# EasyEDA Pro project RealisticPM_2026-10-08.epro, schematic segment_1
Create Date: 2025-02-17; Page Name: P1; Project Name: RealisticPM; Schematic Name: segment_1; Update Date: 2025-02-20; Company: EasyEDA.com; Page Size: A4; Version: V1.0
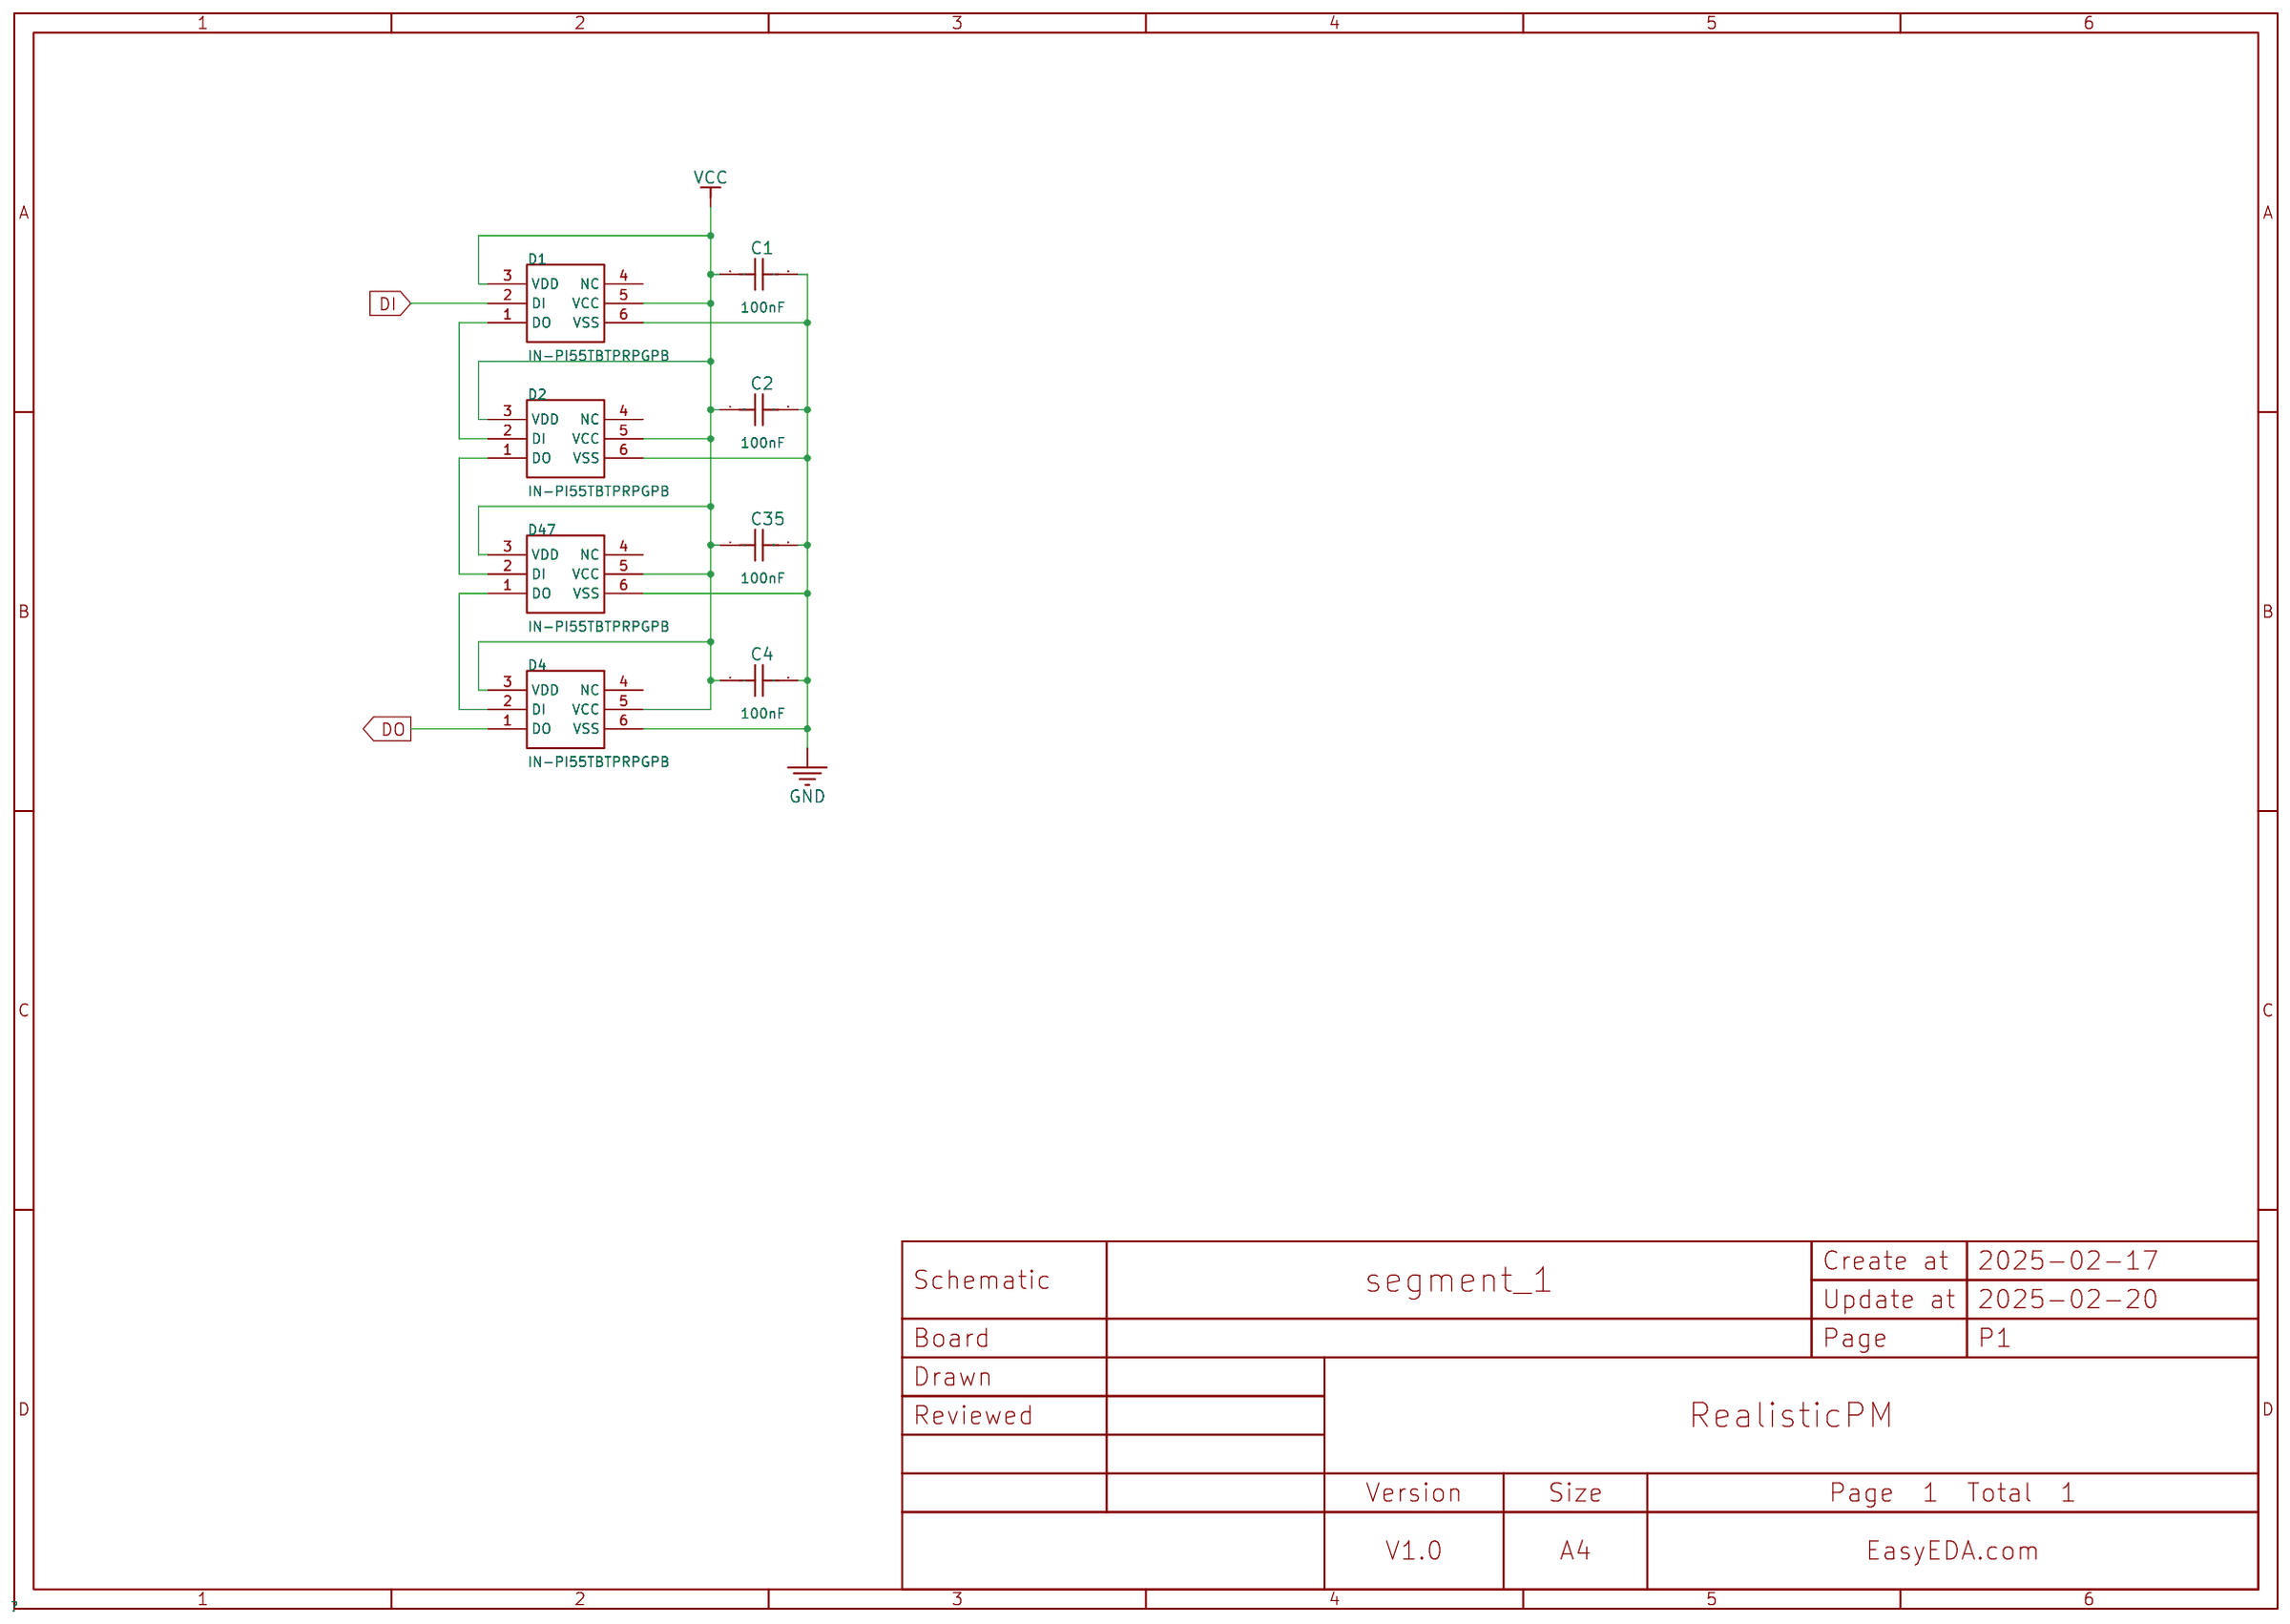
[diagram p1: schematic sheet]

## Parts
C1  100nF  [C0603]
C2  100nF  [C0603]
C4  100nF  [C0603]
C35  100nF  [C0603]
D1  IN-PI55TBTPRPGPB  [LED-SMD_6P-L5.0-W5.0-P1.60-LS5.4_A-SC5050ARGBC-B01-03-1T]
D2  IN-PI55TBTPRPGPB  [LED-SMD_6P-L5.0-W5.0-P1.60-LS5.4_A-SC5050ARGBC-B01-03-1T]
D4  IN-PI55TBTPRPGPB  [LED-SMD_6P-L5.0-W5.0-P1.60-LS5.4_A-SC5050ARGBC-B01-03-1T]
D47  IN-PI55TBTPRPGPB  [LED-SMD_6P-L5.0-W5.0-P1.60-LS5.4_A-SC5050ARGBC-B01-03-1T]

## Library data of the parts
C1 C2 C4 C35 = CL10B104KB8NNNC: Capacitance: Tolerance:±10% Tolerance:±10% Voltage Rated: Temperature Coefficient:; LCSC Part Name: 100nF ±10% 50V; Supplier Part: C1591; Manufacturer: SAMSUNG(三星); Supplier Footprint: 0603; JLCPCB Part Class: Extended Part; Datasheet: https://atta.szlcsc.com/upload/public/pdf/source/20160218/1457707763339.pdf; Supplier: LCSC; Tolerance: ±10%
D1 D2 D4 D47 = IN-PI55TBTPRPGPB: LED Top View / PLCC / 5.0x5.0x1.6 / 6-pin / Tricolor with IC; Manufacturer: Innolux; Supplier: Mouser; Supplier Part: 743-IN-PI55TBTPRPGPB

## Nets
GND: C1.2 C2.2 C4.2 C35.2 D1.6(VSS) D2.6(VSS) D4.6(VSS) D47.6(VSS)
VCC: C1.1 C2.1 C4.1 C35.1 D1.3(VDD) D1.5(VCC) D2.3(VDD) D2.5(VCC) D4.3(VDD) D4.5(VCC) D47.3(VDD) D47.5(VCC)
DI: D1.2(DI)
DO: D4.1(DO)
Net-(D1-1): D1.1(DO) D2.2(DI)
Net-(D2-1): D2.1(DO) D47.2(DI)
Net-(D4-2): D4.2(DI) D47.1(DO)

Not connected (* = marked no-connect by the designer): D1 4(NC); D2 4(NC); D4 4(NC); D47 4(NC)
